# Altium schematic sheet UART.SchDoc
size A4
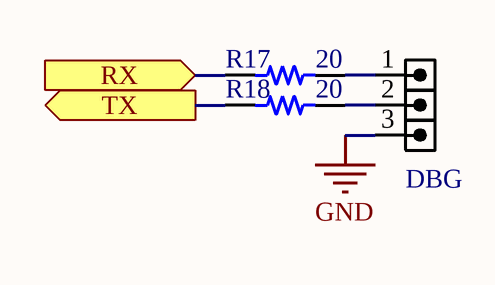
[diagram p0: UART.SchDoc]

## Parts
DBG  HDR3  [HDR1SE_M_1X3]  (value not drawn)
R17  20  [RES 0603_1608]
R18  20  [RES 0603_1608]

## Ports
RX (in), TX (out)

## Nets
GND: DBG.3
RX: R17.1 ; port RX
TX: R18.1 ; port TX
NetDBG_1: DBG.1 R17.2
NetDBG_2: DBG.2 R18.2

## Library data of the parts
DBG = HDRTST_1X3: HEADER, 1mm pitch, test, SMD; VALUE: HDR3
R17 R18 = Res 0603: SMT Resistor; VALUE: 20